# EAGLE design 7 seg featherwing rev A (EAGLE 6.4)
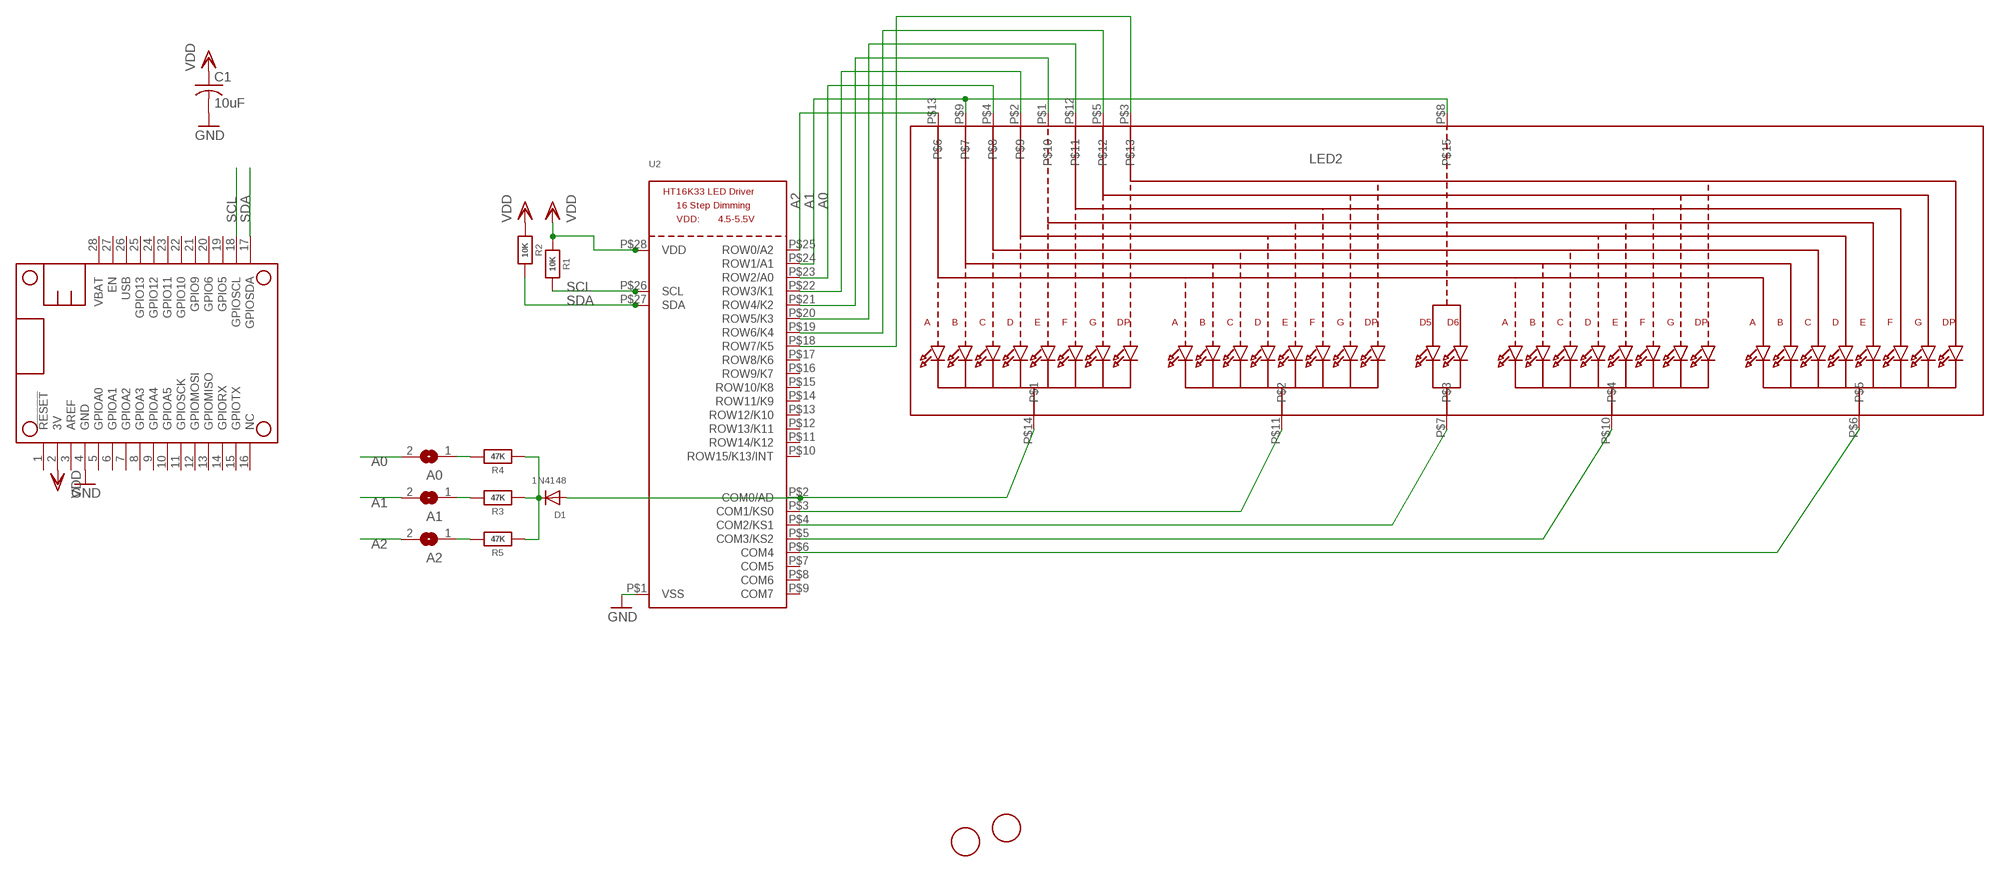
[diagram p0: schematic, sheet 1]

## Parts
A0  SOLDERJUMPERREFLOW_NOPASTE  [SOLDERJUMPER_REFLOW_NOPASTE]
A1  SOLDERJUMPERREFLOW_NOPASTE  [SOLDERJUMPER_REFLOW_NOPASTE]
A2  SOLDERJUMPERREFLOW_NOPASTE  [SOLDERJUMPER_REFLOW_NOPASTE]
C1  10uF  C-USC0805K  [C0805K]
D1  1N4148  DIODESOD-323F  [SOD-323F]
LED2  DISP_SEGMENT_4DIGIT_BL-Q56C43  [SEGMENT-BL-Q56C43]
MS1  FEATHERWING  [FEATHERWING]
R1  10K  RESISTOR0805_NOOUTLINE  [0805-NO]
R2  10K  RESISTOR0805_NOOUTLINE  [0805-NO]
R3  47K  RESISTOR0805_NOOUTLINE  [0805-NO]
R4  47K  RESISTOR0805_NOOUTLINE  [0805-NO]
R5  47K  RESISTOR0805_NOOUTLINE  [0805-NO]
U2  HT16K33_SOP28_SKINNY  [SOP28_300MIL_SKINNY]
U$1  FIDUCIAL  [FIDUCIAL_1MM]
U$2  FIDUCIAL  [FIDUCIAL_1MM]

## Nets
A0: A0.2 LED2.P$4 U2.P$23(ROW2/A0)
A1: A1.2 LED2.P$8 LED2.P$9 U2.P$24(ROW1/A1)
A2: A2.2 LED2.P$13 U2.P$25(ROW0/A2)
GND: C1.2 MS1.4(GND) U2.P$1(VSS)
N$1: D1.C R3.1 R4.1 R5.1
N$2: D1.A LED2.P$14 U2.P$2(COM0/AD)
N$3: LED2.P$11 U2.P$3(COM1/KS0)
N$4: LED2.P$7 U2.P$4(COM2/KS1)
N$5: LED2.P$10 U2.P$5(COM3/KS2)
N$6: LED2.P$6 U2.P$6(COM4)
N$7: A2.1 R5.2
N$10: LED2.P$2 U2.P$22(ROW3/K1)
N$11: LED2.P$1 U2.P$21(ROW4/K2)
N$12: LED2.P$12 U2.P$20(ROW5/K3)
N$13: LED2.P$5 U2.P$19(ROW6/K4)
N$16: LED2.P$3 U2.P$18(ROW7/K5)
N$19: A1.1 R3.2
N$20: A0.1 R4.2
SCL: MS1.18(GPIOSCL) R1.2 U2.P$26(SCL)
SDA: MS1.17(GPIOSDA) R2.2 U2.P$27(SDA)
VDD: C1.1 MS1.2(3V) R1.1 R2.1 U2.P$28(VDD)
Unconnected: MS1.1(!RESET) MS1.3(AREF) MS1.5(GPIOA0) MS1.6(GPIOA1) MS1.7(GPIOA2) MS1.8(GPIOA3) MS1.9(GPIOA4) MS1.10(GPIOA5) MS1.11(GPIOSCK) MS1.12(GPIOMOSI) MS1.13(GPIOMISO) MS1.14(GPIORX) MS1.15(GPIOTX) MS1.16(NC) MS1.19(GPIO5) MS1.20(GPIO6) MS1.21(GPIO9) MS1.22(GPIO10) MS1.23(GPIO11) MS1.24(GPIO12) MS1.25(GPIO13) MS1.26(USB) MS1.27(EN) MS1.28(VBAT) U2.P$7(COM5) U2.P$8(COM6) U2.P$9(COM7) U2.P$10(ROW15/K13/INT) U2.P$11(ROW14/K12) U2.P$12(ROW13/K11) U2.P$13(ROW12/K10) U2.P$14(ROW11/K9) U2.P$15(ROW10/K8) U2.P$16(ROW9/K7) U2.P$17(ROW8/K6)

## Library data of the parts
A0 A1 A2 = microbuilder:SOLDERJUMPER: SMD Solder JUMPER Solder the two pads together to create a connection, or remove the solder to break it. REFLOW - Use this footprint for solder paste and reflow ovens. WAVE - Use this footprint for hand-soldering (larger pads). CLOSED - Has a trace between the two pads to ensure it is closed by default. The trace needs to be cut to disable the jumper, and can be closed again by creating a solder bridge between the two pads.
C1 = adafruit:C-US: CAPACITOR, American symbol
D1 = adafruit:DIODE: Diode SMADIODE - SMA Surface Mount Package 20V 1A Schottky Diode Digikey: 641-1014-6-ND DO-1N4148 - Through Hole Small Current Diode SOD-123 20V 1 A (.5mV Vf) Schottky Diode - Digikey: MBRX120TPMSCT-ND SOD-323 10V 570mA (.38mV Vf, 3ns) Schottky Diode - Digikey: ZLLS410CT-ND SOD-523 30V 30mA Schottky Diode (RB751S-40TE61) - Digikey: RB751S-40TE61CT-ND SOT23-R/W - SOT23 Package (R = Solder Paste/Reflow Ovens, W = Hand-Soldering) BAT54Film 40V 300mA - Digikey: 497-7162-1-ND
LED2 = microbuilder:DISP_SEGMENT_4DIGIT_BL-Q56C43
MS1 = microbuilder:FEATHERWING
R1-R5 = microbuilder:RESISTOR: Resistors For new designs, use the packages preceded by an '_' character since they are more reliable: The following footprints should be used on most boards: _0402 - Standard footprint for regular board layouts _0603 - Standard footprint for regular board layouts _0805 - Standard footprint for regular board layouts _1206 - Standard footprint for regular board layouts For extremely tight-pitch boards where space is at a premium, the following 'micro-pitch' footprints can be used (smaller pads, no silkscreen outline, etc.): _0402MP - Micro-pitch footprint for very dense/compact boards _0603MP - Micro-pitch footprint for very dense/compact boards _0805MP - Micro-pitch footprint for very dense/compact boards _1206MP - Micro-pitch footprint for very dense/compact boards
U2 = microbuilder:HT16K33_SOP28
U$1 U$2 = adafruit:FIDUCIAL: For use by pick and place machines to calibrate the vision/machine, 1mm By microbuilder.eu

## Board
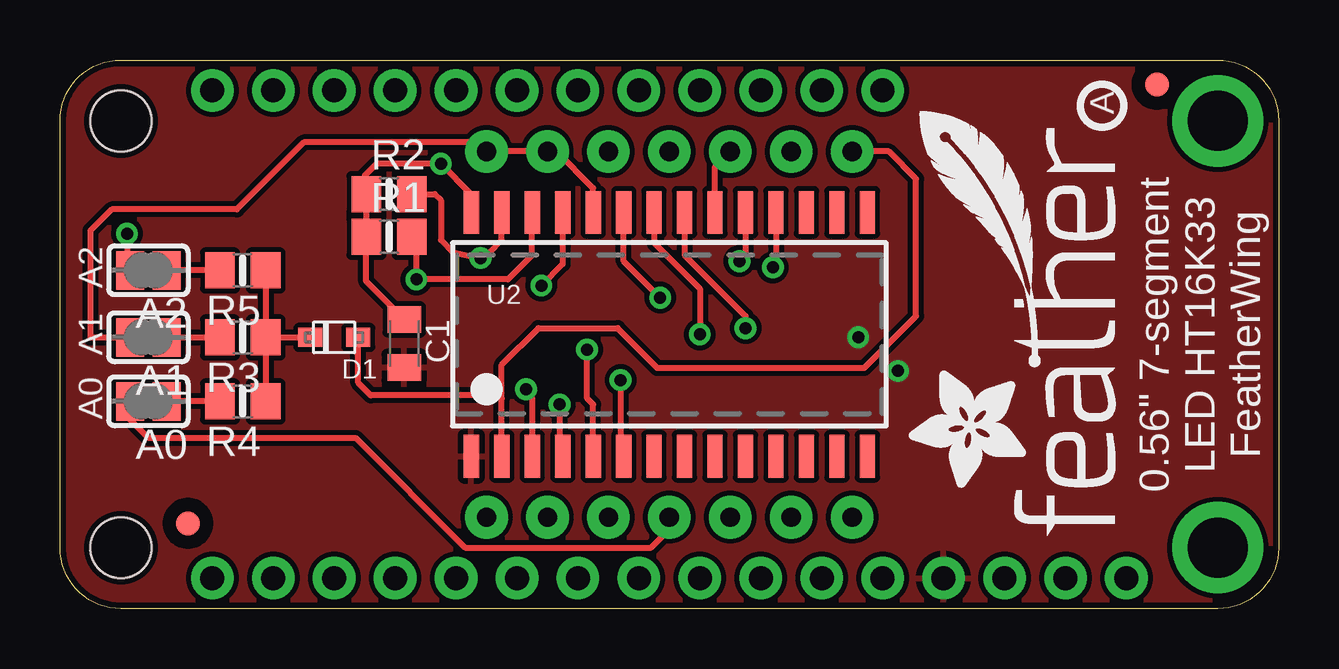
[diagram p1: board, top side]
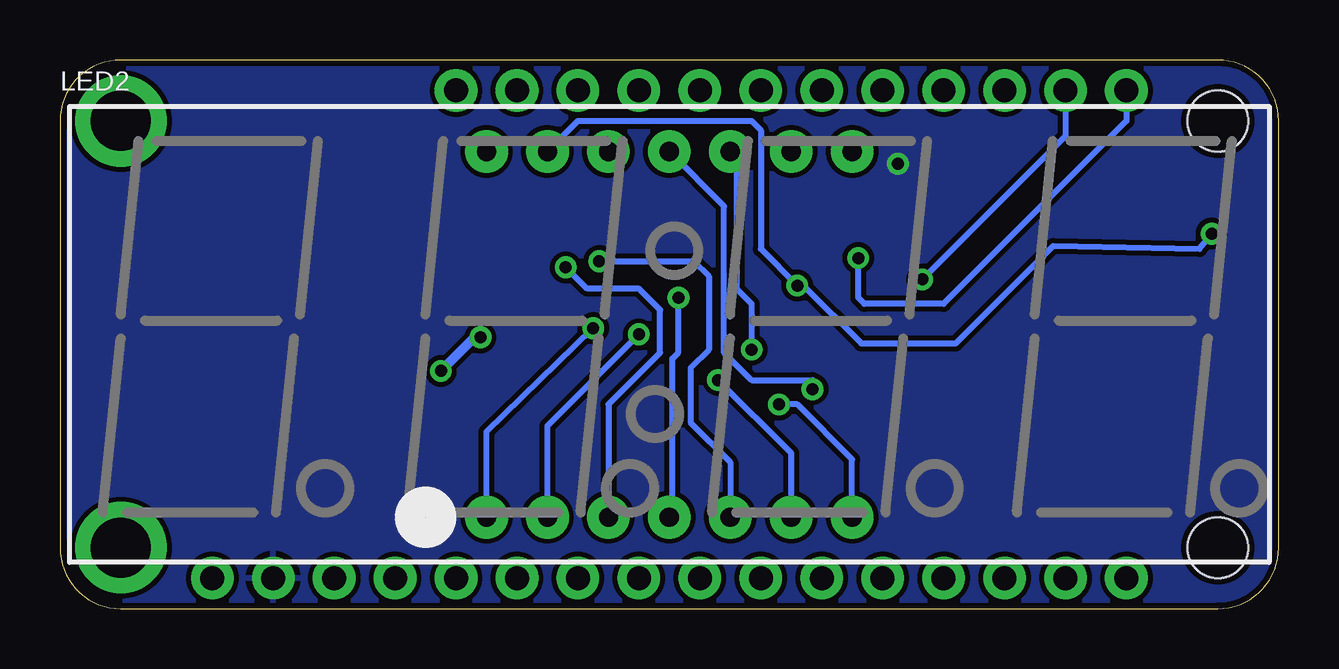
[diagram p2: board, bottom side, seen from below]

Size 50.8 x 22.86 mm. Coordinates in mm from the lower left corner, seen from the top.
Copper layers (1*16): Top 0.035mm / dielectric 1.5mm / Bottom 0.035mm
Design rules "adafruit": minimum track width 8mil, minimum drill 15.5mil, track to track 8mil, track to pad 8mil, pad to pad 8mil, via to via 8mil, smd to smd 8mil, copper to edge 10mil, drill to drill 8mil, minimum pad ring 10mil, minimum via ring 8mil, stop-mask expansion 2mil, vias tented up to drill 20mil, thermal gap 10mil

### Footprints (pad centres in the part's own frame; a part is rotated, then mirrored left to right if it is on the bottom)
SOLDERJUMPER_REFLOW_NOPASTE = smd 1.168 x 1.6: 1 -0.762,0; 2 0.762,0
C0805K = smd 1.1 x 1.4: 1 -1,0; 2 1,0
SOD-323F = smd 1 x 0.8: A -1,0; C 1,0
SEGMENT-BL-Q56C43 = drill 0.8 pad 1.778: P$1 -7.62,-7.62; P$2 -5.08,-7.62; P$3 -2.54,-7.62; P$4 0,-7.62; P$5 2.54,-7.62; P$6 5.08,-7.62; P$7 7.62,-7.62; P$8 7.62,7.62; P$9 5.08,7.62; P$10 2.54,7.62; P$11 0,7.62; P$12 -2.54,7.62; P$13 -5.08,7.62; P$14 -7.62,7.62
FEATHERWING = drill 1 pad 1.778: 1 6.35,1.27; 2 8.89,1.27; 3 11.43,1.27; 4 13.97,1.27; 5 16.51,1.27; 6 19.05,1.27; 7 21.59,1.27; 8 24.13,1.27; 9 26.67,1.27; 10 29.21,1.27; 11 31.75,1.27; 12 34.29,1.27; 13 36.83,1.27; 14 39.37,1.27; 15 41.91,1.27; 16 44.45,1.27; 17 44.45,21.59; 18 41.91,21.59; 19 39.37,21.59; 20 36.83,21.59; 21 34.29,21.59; 22 31.75,21.59; 23 29.21,21.59; 24 26.67,21.59; 25 24.13,21.59; 26 21.59,21.59; 27 19.05,21.59; 28 16.51,21.59 | drill 2.5 pad 3.81: P$1 2.54,20.32; P$2 2.54,2.54 | hole 2.54: 48.26,20.32; 48.26,2.54
0805-NO = smd 1.24 x 1.5: 1 -0.95,0; 2 0.95,0
SOP28_300MIL_SKINNY = smd 0.635 x 1.778: P$1 -8.255,-5.08; P$2 -6.985,-5.08; P$3 -5.715,-5.08; P$4 -4.445,-5.08; P$5 -3.175,-5.08; P$6 -1.905,-5.08; P$7 -0.635,-5.08; P$8 0.635,-5.08; P$9 1.905,-5.08; P$10 3.175,-5.08; P$11 4.445,-5.08; P$12 5.715,-5.08; P$13 6.985,-5.08; P$14 8.255,-5.08; P$15 8.255,5.08; P$16 6.985,5.08; P$17 5.715,5.08; P$18 4.445,5.08; P$19 3.175,5.08; P$20 1.905,5.08; P$21 0.635,5.08; P$22 -0.635,5.08; P$23 -1.905,5.08; P$24 -3.175,5.08; P$25 -4.445,5.08; P$26 -5.715,5.08; P$27 -6.985,5.08; P$28 -8.255,5.08
FIDUCIAL_1MM = smd 1 x 1: 1 0,0

### Placement (x,y rotation side)
A0  3.68,8.64 180 top
A1  3.68,11.3 180 top
A2  3.68,14.1 180 top
C1  14.35,11.05 270 top
D1  11.43,11.3 180 top
LED2  25.4,11.43 0 bottom
MS1  50.8,0 0 bottom
R1  13.72,15.49 0 top
R2  13.72,17.27 0 top
R3  7.62,11.3 180 top
R4  7.62,8.64 180 top
R5  7.62,14.1 180 top
U2  25.4,11.43 0 top
U$1  45.72,21.84 0 top
U$2  5.33,3.56 0 top
U$3  [ADAFRUIT_5MM]  40.26,9.91 180 top
U$4  [PCBFEAT-REV-040]  43.43,20.95 90 top
U$5  [FEATHERLOGO_MED]  44.07,2.92 90 top

### Tracks (layer width: path | path; a pad name or v marks a point on that pad's centre or on a via)
A0  (via drill 0.5)
  Top 0.254: v25.02,12.95 23.49,14.48 U2.P$23 | A0.2 2.92,7.87 3.68,7.11 12.32,7.11 16.89,2.54 24.64,2.54 25.4,3.3 LED2.P$4
  Bottom 0.254: LED2.P$4 25.27,3.94 25.27,10.41 25.02,10.67 v25.02,12.95
A1
  Top 0.254: U2.P$24 22.22,17.53 20.7,19.05 LED2.P$9 LED2.P$8 17.4,19.43 10.16,19.43 7.37,16.64 2.16,16.64 1.27,15.75 1.27,11.3 A1.2
A2  (via drill 0.5)
  Top 0.254: U2.P$25 20.95,14.35 v20.07,13.46 | v2.79,15.62 2.79,14.22 A2.2
  Bottom 0.254: v2.79,15.62 3.3,14.99 9.4,15.11 13.46,11.05 17.4,11.05 19.81,13.46 v20.07,13.46 21.59,14.99 21.59,19.94 21.97,20.32 29.21,20.32 LED2.P$13
GND  (via drill 0.5)
  Bottom 0.406: v33.27,11.3 33.53,11.3 v34.92,9.91
  pour Top: 0,22.86 0,0 50.8,0 50.8,22.86
N$1
  Top 0.254: R5.1 R3.1 | R3.1 R4.1 | R3.1 D1.C
N$2
  Top 0.254: D1.A 12.43,9.41 12.95,8.89 18.29,8.89 18.41,8.76 U2.P$2 18.41,10.16 19.94,11.68 23.24,11.68 24.89,10.03 33.53,10.03 35.69,12.19 35.69,17.91 34.54,19.05 LED2.P$14
N$3  (via drill 0.5)
  Top 0.254: v19.43,9.14 19.68,8.76 U2.P$3
  Bottom 0.254: v19.43,9.14 19.43,9.53 21.97,9.53 23.11,10.67 23.11,16.76 LED2.P$11
N$4  (via drill 0.5)
  Top 0.254: v20.83,8.51 20.83,6.48 U2.P$4
  Bottom 0.254: LED2.P$7 17.78,6.22 20.07,8.51 v20.83,8.51
N$5  (via drill 0.5)
  Top 0.254: U2.P$5 22.22,8.51 21.97,8.76 v21.97,10.79
  Bottom 0.254: LED2.P$10 22.61,18.8 22.61,13.33 21.97,12.7 v21.97,10.79
N$6  (via drill 0.5)
  Top 0.254: v23.37,9.53 23.37,6.48 U2.P$6
  Bottom 0.254: LED2.P$6 20.32,6.48 v23.37,9.53
N$7
  Top 0.254: R5.2 A2.1
N$10  (via drill 0.5)
  Top 0.254: U2.P$22 24.76,15.24 26.67,13.33 v26.67,11.43
  Bottom 0.254: LED2.P$2 30.48,7.62 v26.67,11.43
N$11  (via drill 0.5)
  Top 0.254: U2.P$21 26.04,14.73 28.57,12.19 v28.57,11.68
  Bottom 0.254: LED2.P$1 33.02,7.37 v28.57,11.68
N$12
  Top 0.254: U2.P$20 27.3,18.41 LED2.P$12
N$13  (via drill 0.5)
  Top 0.254: U2.P$19 28.57,14.73 v28.32,14.48
  Bottom 0.254: v28.32,14.48 24.38,14.48 23.75,13.84 23.75,10.79 24.51,10.03 24.51,7.75 22.86,6.1 LED2.P$5
N$16  (via drill 0.5)
  Top 0.254: U2.P$18 29.84,14.35 v29.72,14.22
  Bottom 0.254: v29.72,14.22 28.83,13.33 26.67,13.33 25.78,12.45 25.78,10.67 27.94,8.51 LED2.P$3
N$19
  Top 0.254: A1.1 R3.2
N$20
  Top 0.254: R4.2 A0.1
SCL  (via drill 0.5)
  Top 0.254: 14.72,15 R1.2 14.86,15.35 v14.86,13.72 18.67,13.72 19.68,14.73 U2.P$26
  Bottom 0.254: MS1.18 8.89,19.69 v14.86,13.72
SDA  (via drill 0.5)
  Top 0.254: R2.2 15.62,17.27 15.87,17.02 15.87,15.37 16.38,14.86 v17.53,14.61 17.91,14.86 18.41,15.37 U2.P$27
  Bottom 0.254: MS1.17 6.35,20.32 13.97,12.7 17.27,12.7 17.53,12.95 v17.53,14.61
VDD  (via drill 0.5)
  Top 0.254: U2.P$28 17.14,17.27 v15.87,18.54 13.21,18.54 12.72,18.05 R2.1 R1.1 12.77,13.63 C1.1
  pour Bottom: 0,22.86 0,0 50.8,0 50.8,22.99

### Text on the board
tPlace: A2 | A1 | 0.56" 7-segment / LED HT16K33 / FeatherWing | A0
tDocu: SCL | SDA | GND | VCC | A2 | A1 | A0